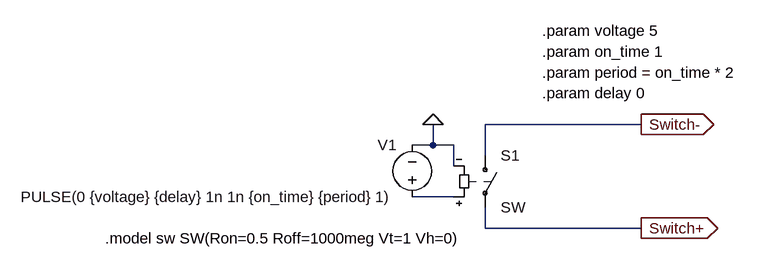
[diagram p0: schematic switch.asc]
switch.asc, the LTspice schematic file:
Version 4
SHEET 1 880 680
WIRE 640 112 400 112
WIRE 320 144 320 112
WIRE 320 144 288 144
WIRE 352 144 320 144
WIRE 400 160 400 112
WIRE 352 176 352 144
WIRE 352 224 288 224
WIRE 400 272 400 240
WIRE 640 272 400 272
FLAG 320 112 0
FLAG 640 112 Switch-
IOPIN 640 112 Out
FLAG 640 272 Switch+
IOPIN 640 272 Out
SYMBOL sw 400 144 R0
SYMATTR InstName S1
SYMBOL voltage 288 240 R180
WINDOW 0 24 96 Left 2
WINDOW 3 24 16 Left 2
WINDOW 123 0 0 Left 0
WINDOW 39 0 0 Left 0
SYMATTR InstName V1
SYMATTR Value PULSE(0 {voltage} {delay} 1n 1n {on_time} {period} 1)
TEXT -184 288 Left 2 !.model sw SW(Ron=0.5 Roff=1000meg Vt=1 Vh=0)
TEXT 488 0 Left 2 !.param on_time 1
TEXT 488 32 Left 2 !.param period = on_time * 2
TEXT 488 64 Left 2 !.param delay 0
TEXT 488 -32 Left 2 !.param voltage 5

The netlist it stands for:
* switch.asc
S1 Switch- Switch+ N001 0 SW
V1 N001 0 PULSE(0 {voltage} {delay} 1n 1n {on_time} {period} 1)
.model sw SW(Ron=0.5 Roff=1000meg Vt=1 Vh=0)
.param on_time 1
.param period = on_time * 2
.param delay 0
.param voltage 5
.backanno
.end